# EAGLE design Bluetooth-Header (EAGLE 5.11)
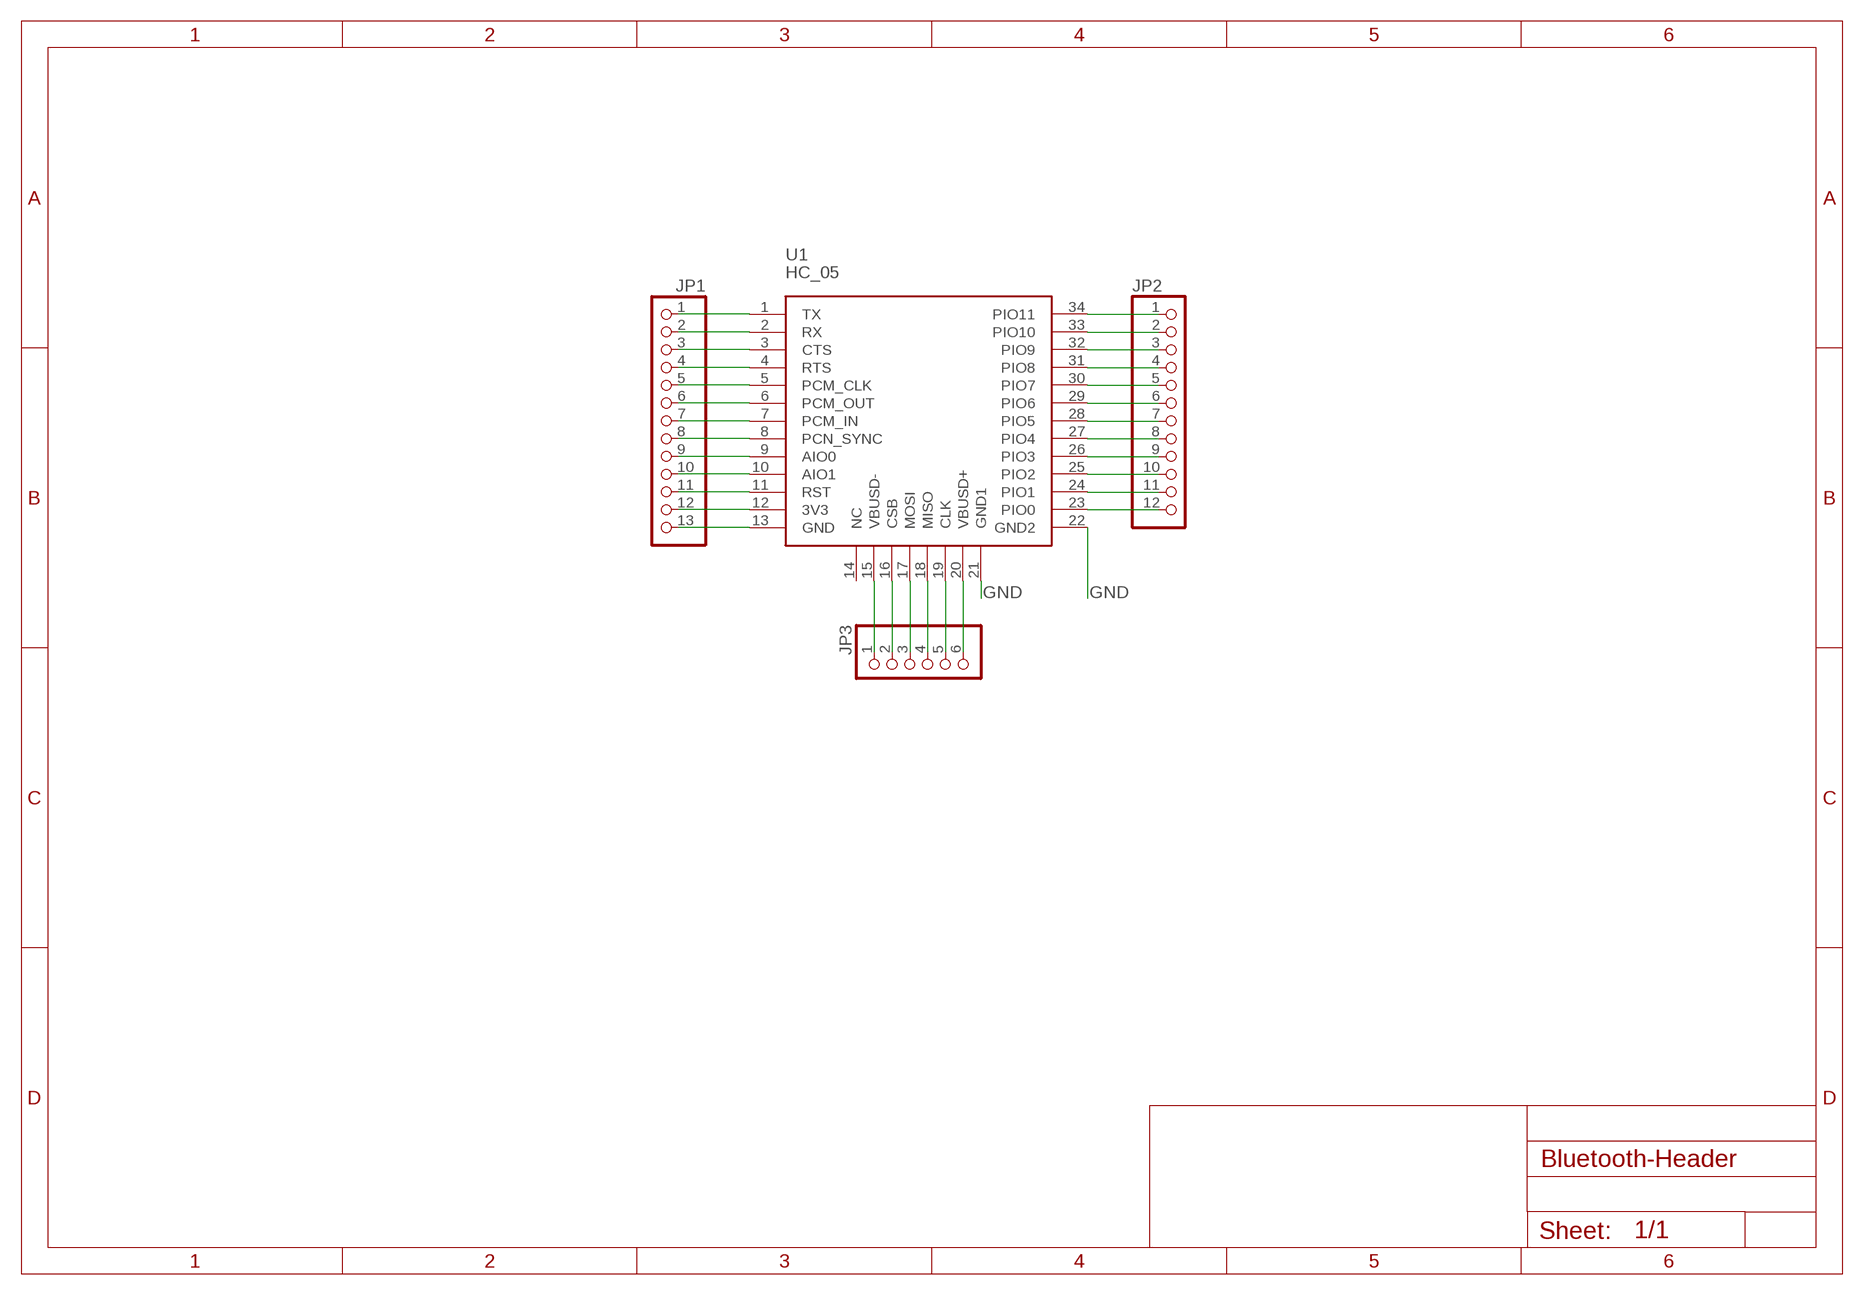
[diagram p0: schematic, sheet 1]

## Parts
JP1  PINHD-1X13_2.54-S  [1X13-S]
JP2  PINHD-1X12_2.54-S  [1X12-S]
JP3  PINHD-1X06_2.54-S  [1X06-S]
U1  HC_05  [BLUETOOTH_SMD]

## Nets
GND: JP1.13 U1.13(GND) U1.21(GND1) U1.22(GND2)
N$1: JP1.1 U1.1(TX)
N$2: JP1.2 U1.2(RX)
N$3: JP1.3 U1.3(CTS)
N$4: JP1.4 U1.4(RTS)
N$5: JP1.5 U1.5(PCM_CLK)
N$6: JP1.6 U1.6(PCM_OUT)
N$7: JP1.7 U1.7(PCM_IN)
N$8: JP1.8 U1.8(PCN_SYNC)
N$9: JP1.9 U1.9(AIO0)
N$10: JP1.10 U1.10(AIO1)
N$11: JP1.11 U1.11(RST)
N$12: JP1.12 U1.12(3V3)
N$15: JP3.1 U1.15(VBUSD-)
N$16: JP3.2 U1.16(CSB)
N$17: JP3.3 U1.17(MOSI)
N$18: JP3.4 U1.18(MISO)
N$19: JP3.5 U1.19(CLK)
N$20: JP3.6 U1.20(VBUSD+)
N$22: JP2.1 U1.34(PIO11)
N$23: JP2.2 U1.33(PIO10)
N$24: JP2.3 U1.32(PIO9)
N$25: JP2.4 U1.31(PIO8)
N$26: JP2.5 U1.30(PIO7)
N$27: JP2.6 U1.29(PIO6)
N$28: JP2.7 U1.28(PIO5)
N$29: JP2.8 U1.27(PIO4)
N$30: JP2.9 U1.26(PIO3)
N$31: JP2.10 U1.25(PIO2)
N$32: JP2.11 U1.24(PIO1)
N$33: JP2.12 U1.23(PIO0)
Unconnected: U1.14(NC)

## Library data of the parts
JP1 = pinhead-2:PINHD-1X13: PIN HEADER
JP2 = pinhead-2:PINHD-1X12: PIN HEADER
JP3 = pinhead-2:PINHD-1X06: PIN HEADER
U1 = SerialPortBluetooth:HC_05

## Board
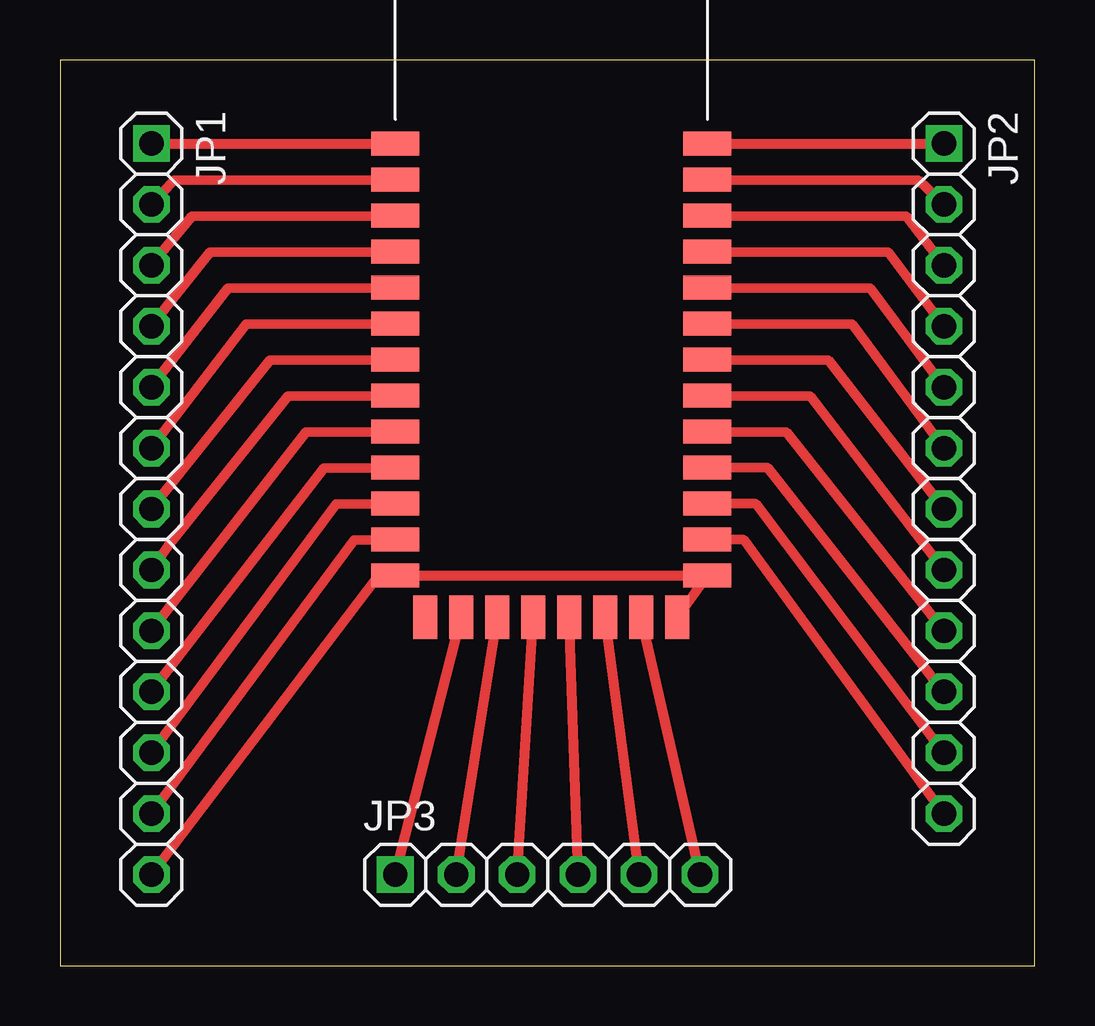
[diagram p1: board, top side]

Size 40.62 x 37.77 mm. Coordinates in mm from the lower left corner, seen from the top.
Outline: 0,0 40.62,0 40.62,37.77 0,37.77 0,0
Copper layers (1*16): Top 0.035mm / dielectric 1.5mm / Bottom 0.035mm
Design rules "default": minimum track width 10mil, minimum drill 24mil, track to track 8mil, track to pad 8mil, pad to pad 8mil, via to via 8mil, smd to smd 8mil, copper to edge 40mil, drill to drill 8mil, minimum pad ring 10mil, minimum via ring 8mil, stop-mask expansion 4mil, vias tented up to drill 0mil, thermal gap 10mil

### Footprints (pad centres in the part's own frame; a part is rotated, then mirrored left to right if it is on the bottom)
1X13-S = drill 1.016 square: 1 -15.24,0 | drill 1.016 octagon: 2 -12.7,0; 3 -10.16,0; 4 -7.62,0; 5 -5.08,0; 6 -2.54,0; 7 0,0; 8 2.54,0; 9 5.08,0; 10 7.62,0; 11 10.16,0; 12 12.7,0; 13 15.24,0
1X12-S = drill 1.016 square: 1 -13.97,0 | drill 1.016 octagon: 2 -11.43,0; 3 -8.89,0; 4 -6.35,0; 5 -3.81,0; 6 -1.27,0; 7 1.27,0; 8 3.81,0; 9 6.35,0; 10 8.89,0; 11 11.43,0; 12 13.97,0
1X06-S = drill 1.016 square: 1 -6.35,0 | drill 1.016 octagon: 2 -3.81,0; 3 -1.27,0; 4 1.27,0; 5 3.81,0; 6 6.35,0
BLUETOOTH_SMD = smd 2 x 1: 1 0,0; 2 0,-1.5; 3 0,-3; 4 0,-4.5; 5 0,-6; 6 0,-7.5; 7 0,-9; 8 0,-10.5; 9 0,-12; 10 0,-13.5; 11 0,-15; 12 0,-16.5; 13 0,-18; 22 13,-18; 23 13,-16.5; 24 13,-15; 25 13,-13.5; 26 13,-12; 27 13,-10.5; 28 13,-9; 29 13,-7.5; 30 13,-6; 31 13,-4.5; 32 13,-3; 33 13,-1.5; 34 13,0 | smd 1 x 1.8: 14 1.25,-19.75; 15 2.75,-19.75; 16 4.25,-19.75; 17 5.75,-19.75; 18 7.25,-19.75; 19 8.75,-19.75; 20 10.25,-19.75; 21 11.75,-19.75

### Placement (x,y rotation side)
JP1  3.81,19.05 270 top
JP2  36.83,20.32 270 top
JP3  20.32,3.81 0 top
U1  13.97,34.29 0 top

### Tracks (layer width: path | path; a pad name or v marks a point on that pad's centre or on a via)
GND
  Top 0.406: U1.21 U1.22 U1.13 13.25,16.25 JP1.13
N$1
  Top 0.406: JP1.1 U1.1
N$2
  Top 0.406: U1.2 4.75,32.75 JP1.2
N$3
  Top 0.406: U1.3 5.5,31.25 JP1.3
N$4
  Top 0.406: U1.4 6.25,29.75 JP1.4
N$5
  Top 0.406: U1.5 7,28.25 JP1.5
N$6
  Top 0.406: U1.6 7.75,26.75 JP1.6
N$7
  Top 0.406: U1.7 8.75,25.25 JP1.7
N$8
  Top 0.406: U1.8 9.5,23.75 4.5,17.5 JP1.8
N$9
  Top 0.406: U1.9 10.25,22.25 JP1.9
N$10
  Top 0.406: U1.10 11,20.75 JP1.10
N$11
  Top 0.406: U1.11 11.5,19.25 JP1.11
N$12
  Top 0.406: U1.12 12.25,17.75 JP1.12
N$15
  Top 0.406: JP3.1 U1.15
N$16
  Top 0.406: JP3.2 U1.16
N$17
  Top 0.406: JP3.3 U1.17
N$18
  Top 0.406: JP3.4 U1.18
N$19
  Top 0.406: JP3.5 U1.19
N$20
  Top 0.406: JP3.6 U1.20
N$22
  Top 0.406: U1.34 JP2.1
N$23
  Top 0.406: U1.33 35.75,32.75 JP2.2
N$24
  Top 0.406: U1.32 35.25,31.25 JP2.3
N$25
  Top 0.406: U1.31 34.5,29.75 JP2.4
N$26
  Top 0.406: U1.30 33.75,28.25 JP2.5
N$27
  Top 0.406: U1.29 33,26.75 JP2.6
N$28
  Top 0.406: U1.28 32,25.25 JP2.7
N$29
  Top 0.406: U1.27 31.25,23.75 JP2.8
N$30
  Top 0.406: U1.26 30.25,22.25 JP2.9
N$31
  Top 0.406: U1.25 29.5,20.75 JP2.10
N$32
  Top 0.406: U1.24 29,19.25 JP2.11
N$33
  Top 0.406: U1.23 28.5,17.75 JP2.12